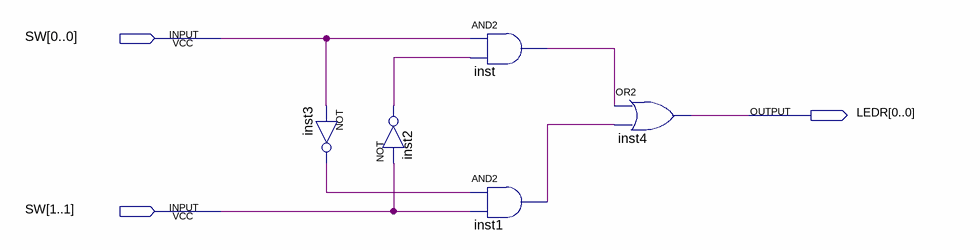
[diagram p0: schematic sheet]
// Quartus schematic XOR_proj_1_241118.bdf as structural Verilog: 5 symbols, 3 pins
module XOR_proj_1_241118 (
  input  [1:0] SW,
  output [0:0] LEDR
);

  wire inst1_out, inst2_out, inst3_out, inst_out;

  not inst3 (inst3_out, SW[0]);
  not inst2 (inst2_out, SW[1]);
  and inst (inst_out, SW[0], inst2_out);
  and inst1 (inst1_out, inst3_out, SW[1]);
  or inst4 (LEDR[0], inst_out, inst1_out);
endmodule
